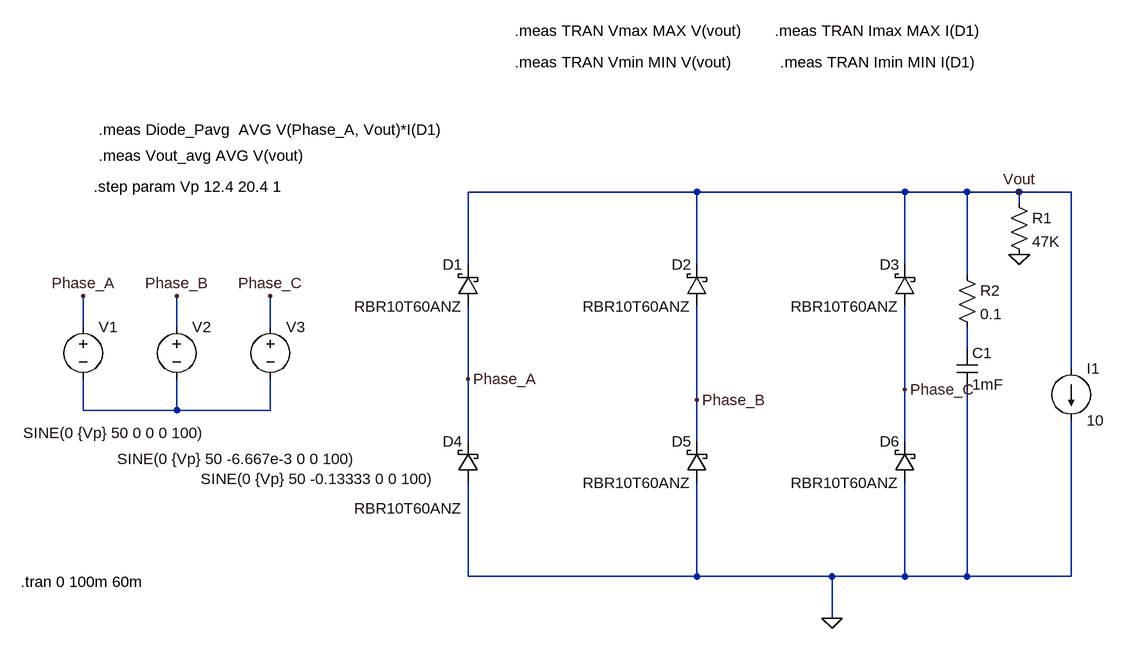
[diagram p0: schematic FBDR.asc]
FBDR.asc, the LTspice schematic file:
Version 4
SHEET 1 1264 680
WIRE 496 0 144 0
WIRE 816 0 496 0
WIRE 912 0 816 0
WIRE 992 0 912 0
WIRE 1072 0 992 0
WIRE 992 16 992 0
WIRE 144 112 144 0
WIRE 496 112 496 0
WIRE 816 112 816 0
WIRE 912 128 912 0
WIRE -448 208 -448 160
WIRE -304 208 -304 160
WIRE -160 208 -160 160
WIRE 912 240 912 208
WIRE 1072 272 1072 0
WIRE 144 288 144 176
WIRE 816 304 816 176
WIRE 496 320 496 176
WIRE -448 336 -448 288
WIRE -304 336 -304 288
WIRE -304 336 -448 336
WIRE -160 336 -160 288
WIRE -160 336 -304 336
WIRE 144 384 144 288
WIRE 496 384 496 320
WIRE 816 384 816 304
WIRE 144 592 144 448
WIRE 496 592 496 448
WIRE 496 592 144 592
WIRE 704 592 496 592
WIRE 816 592 816 448
WIRE 816 592 704 592
WIRE 912 592 912 304
WIRE 912 592 816 592
WIRE 1072 592 1072 352
WIRE 1072 592 912 592
WIRE 704 656 704 592
FLAG 704 656 0
FLAG -448 160 Phase_A
FLAG -304 160 Phase_B
FLAG -160 160 Phase_C
FLAG 144 288 Phase_A
FLAG 496 320 Phase_B
FLAG 816 304 Phase_C
FLAG 992 0 Vout
FLAG 992 96 0
SYMBOL schottky 160 176 R180
WINDOW 0 24 64 Left 2
WINDOW 3 24 0 Left 2
SYMATTR InstName D1
SYMATTR Value RBR10T60ANZ
SYMATTR Description Diode
SYMATTR Type diode
SYMBOL schottky 512 176 R180
WINDOW 0 24 64 Left 2
WINDOW 3 24 0 Left 2
SYMATTR InstName D2
SYMATTR Value RBR10T60ANZ
SYMATTR Description Diode
SYMATTR Type diode
SYMBOL schottky 832 176 R180
WINDOW 0 24 64 Left 2
WINDOW 3 24 0 Left 2
SYMATTR InstName D3
SYMATTR Value RBR10T60ANZ
SYMATTR Description Diode
SYMATTR Type diode
SYMBOL schottky 160 448 R180
WINDOW 0 24 64 Left 2
WINDOW 3 24 -39 Left 2
SYMATTR InstName D4
SYMATTR Value RBR10T60ANZ
SYMATTR Description Diode
SYMATTR Type diode
SYMBOL schottky 512 448 R180
WINDOW 0 24 64 Left 2
WINDOW 3 24 0 Left 2
SYMATTR InstName D5
SYMATTR Value RBR10T60ANZ
SYMATTR Description Diode
SYMATTR Type diode
SYMBOL schottky 832 448 R180
WINDOW 0 24 64 Left 2
WINDOW 3 24 0 Left 2
SYMATTR InstName D6
SYMATTR Value RBR10T60ANZ
SYMATTR Description Diode
SYMATTR Type diode
SYMBOL voltage -448 192 R0
WINDOW 3 -92 179 Left 2
WINDOW 123 0 0 Left 0
WINDOW 39 0 0 Left 0
SYMATTR Value SINE(0 {Vp} 50 0 0 0 100)
SYMATTR InstName V1
SYMBOL current 1072 272 R0
WINDOW 123 0 0 Left 0
WINDOW 39 0 0 Left 0
SYMATTR InstName I1
SYMATTR Value 10
SYMBOL voltage -304 192 R0
WINDOW 3 -92 219 Left 2
WINDOW 123 0 0 Left 0
WINDOW 39 0 0 Left 0
SYMATTR Value SINE(0 {Vp} 50 -6.667e-3 0 0 100)
SYMATTR InstName V2
SYMBOL voltage -160 192 R0
WINDOW 3 -107 250 Left 2
WINDOW 123 0 0 Left 0
WINDOW 39 0 0 Left 0
SYMATTR Value SINE(0 {Vp} 50 -0.13333 0 0 100)
SYMATTR InstName V3
SYMBOL res 976 0 R0
SYMATTR InstName R1
SYMATTR Value 47K
SYMBOL res 896 112 R0
SYMATTR InstName R2
SYMATTR Value 0.1
SYMBOL cap 896 240 R0
SYMATTR InstName C1
SYMATTR Value 1mF
TEXT -432 -8 Left 2 !.step param Vp 12.4 20.4 1
TEXT -544 600 Left 2 !.tran 0 100m 60m
TEXT -424 -96 Left 2 !.meas Diode_Pavg  AVG V(Phase_A, Vout)*I(D1)
TEXT -424 -56 Left 2 !.meas Vout_avg AVG V(vout)
TEXT 216 -248 Left 2 !.meas TRAN Vmax MAX V(vout)
TEXT 216 -200 Left 2 !.meas TRAN Vmin MIN V(vout)
TEXT 616 -248 Left 2 !.meas TRAN Imax MAX I(D1)
TEXT 624 -200 Left 2 !.meas TRAN Imin MIN I(D1)

The netlist it stands for:
* FBDR.asc
D1 Phase_A Vout RBR10T60ANZ
D2 Phase_B Vout RBR10T60ANZ
D3 Phase_C Vout RBR10T60ANZ
D4 0 Phase_A RBR10T60ANZ
D5 0 Phase_B RBR10T60ANZ
D6 0 Phase_C RBR10T60ANZ
V1 Phase_A N002 SINE(0 {Vp} 50 0 0 0 100)
I1 Vout 0 10
V2 Phase_B N002 SINE(0 {Vp} 50 -6.667e-3 0 0 100)
V3 Phase_C N002 SINE(0 {Vp} 50 -0.13333 0 0 100)
R1 Vout 0 47K
R2 Vout N001 0.1
C1 N001 0 1mF
.model D D
.lib standard.dio
.step param Vp 12.4 20.4 1
.tran 0 100m 60m
.meas Diode_Pavg  AVG V(Phase_A, Vout)*I(D1)
.meas Vout_avg AVG V(vout)
.meas TRAN Vmax MAX V(vout)
.meas TRAN Vmin MIN V(vout)
.meas TRAN Imax MAX I(D1)
.meas TRAN Imin MIN I(D1)
.backanno
.end